# Altium schematic sheet USB-C_Power_Supply.SchDoc: USB-C Breadboard Power Supply
size A3; Author: Adrian S; Revision: 1.0; SheetNumber: 1; SheetTotal: 1
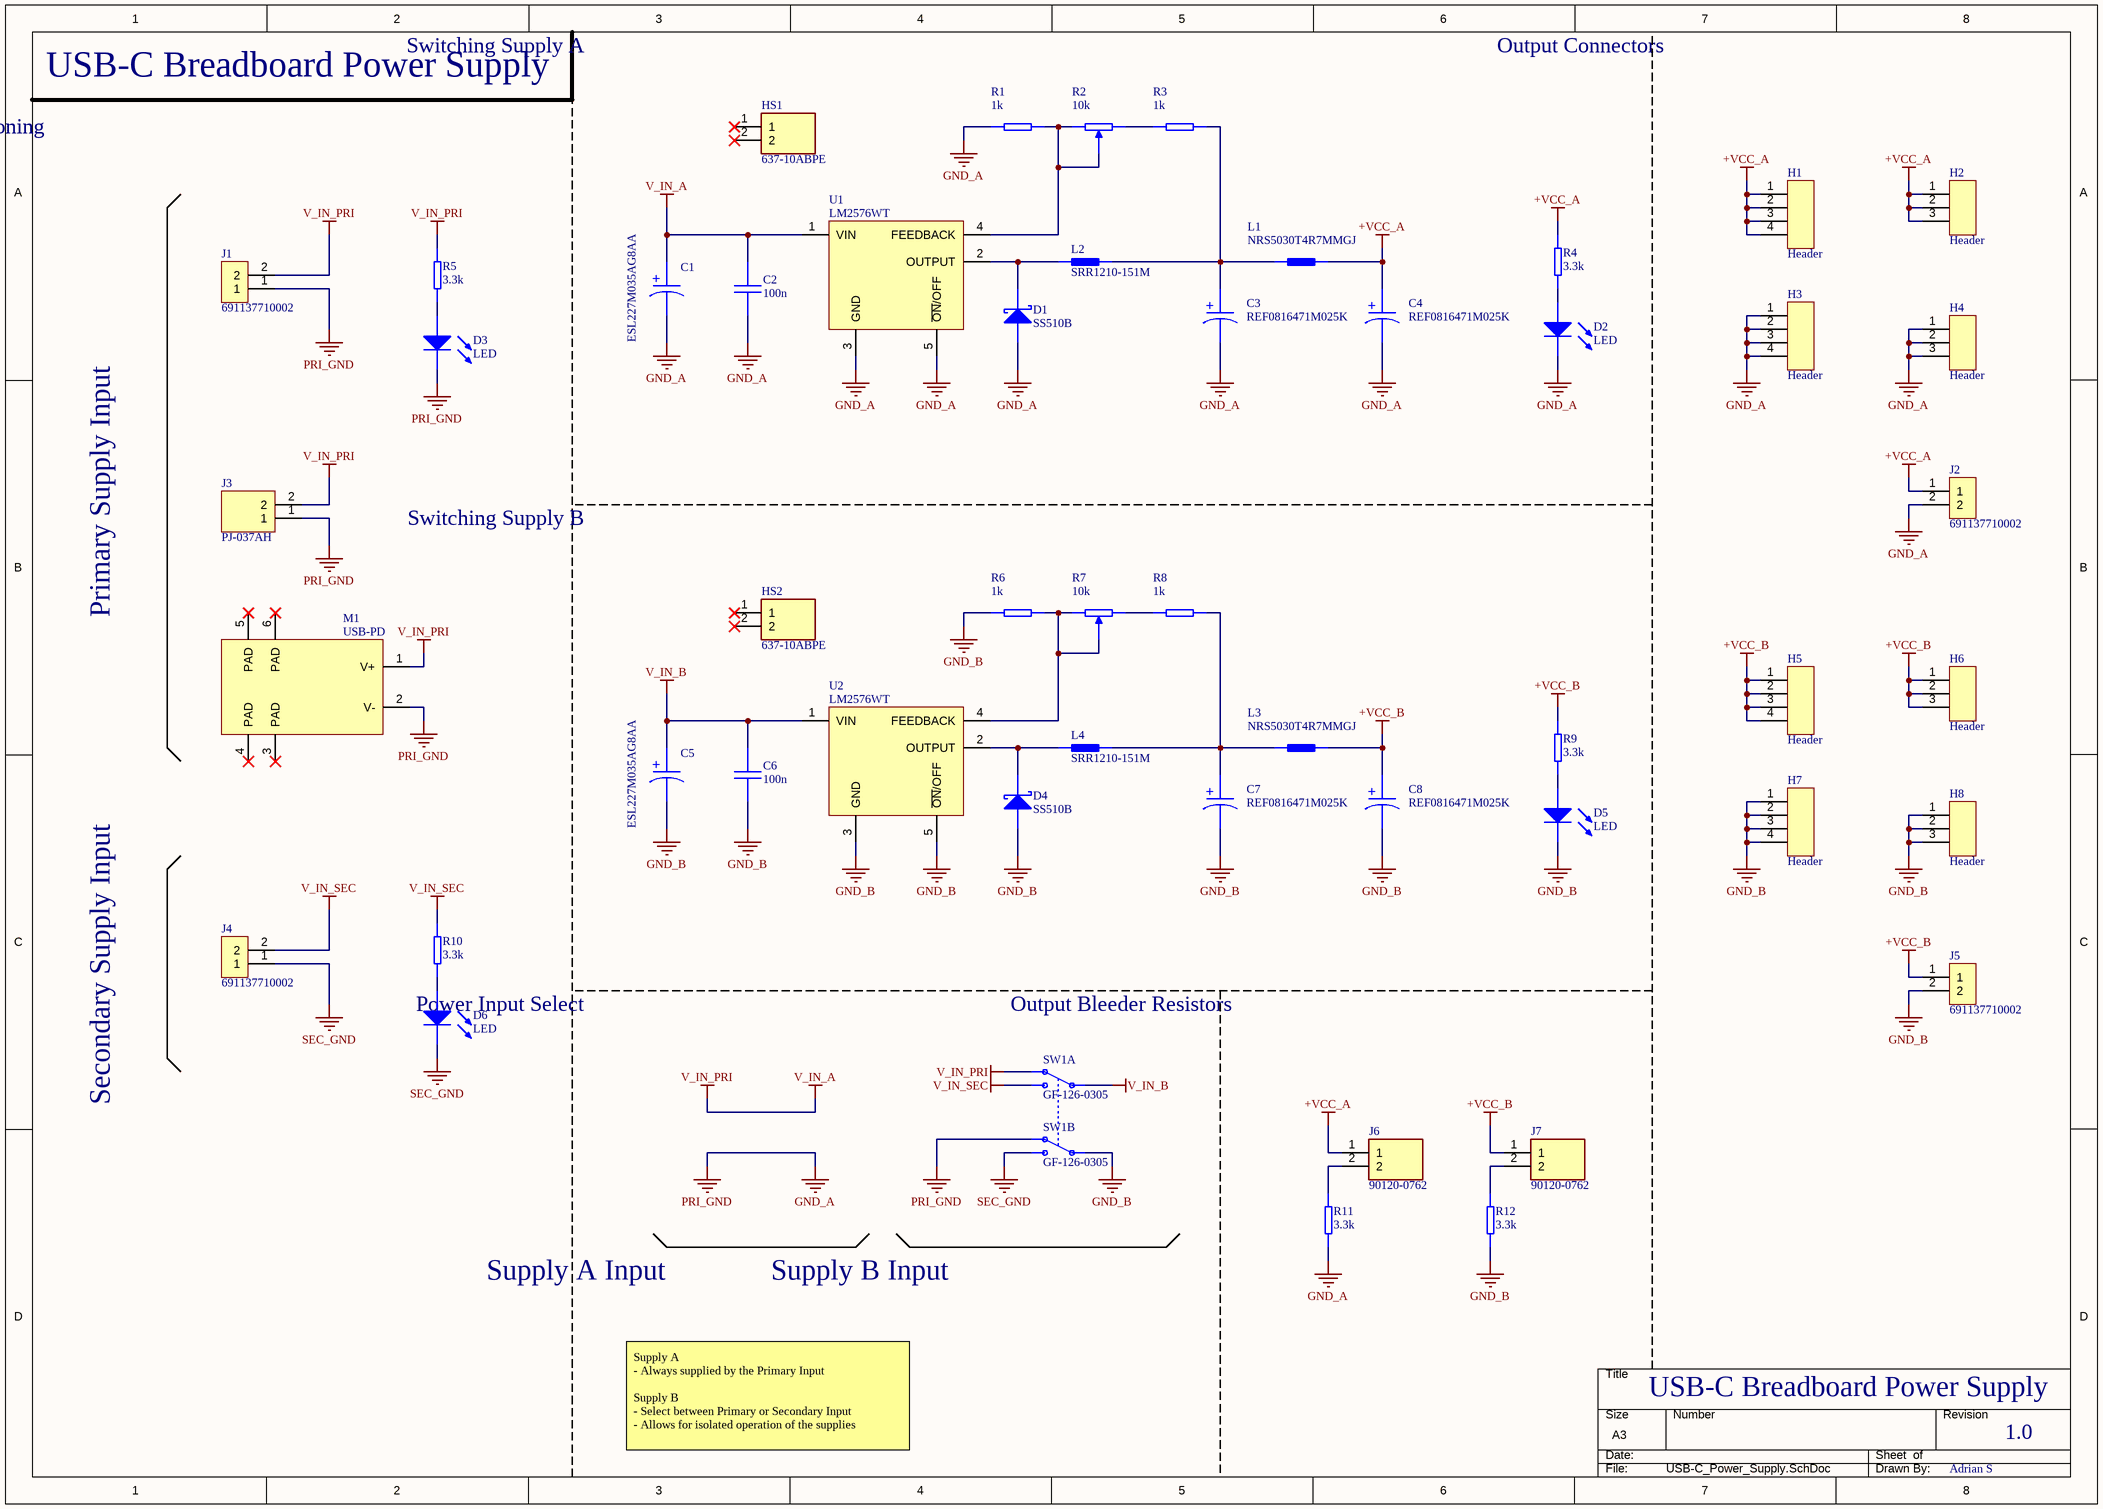
[diagram p0: USB-C_Power_Supply.SchDoc]

## Parts
C1  ESL227M035AG8AA  [CAPTH8.00X18.00-3.50]
C2  100n  [CAP0805]
C3  REF0816471M025K  [CAPTH8.00X16.00-3.50]
C4  REF0816471M025K  [CAPTH8.00X16.00-3.50]
C5  ESL227M035AG8AA  [CAPTH8.00X18.00-3.50]
C6  100n  [CAP0805]
C7  REF0816471M025K  [CAPTH8.00X16.00-3.50]
C8  REF0816471M025K  [CAPTH8.00X16.00-3.50]
D1  SS510B  [DO-214AC (SMA)]
D2  LED  [LEDM2012X80N]
D3  LED  [LEDM2012X80N]
D4  SS510B  [DO-214AC (SMA)]
D5  LED  [LEDM2012X80N]
D6  LED  [LEDM2012X80N]
H1  Header  [Header_1X4]
H2  Header  [Header_1X3]
H3  Header  [Header_1X4]
H4  Header  [Header_1X3]
H5  Header  [Header_1X4]
H6  Header  [Header_1X3]
H7  Header  [Header_1X4]
H8  Header  [Header_1X3]
HS1  637-10ABPE  [63710ABPE]
HS2  637-10ABPE  [63710ABPE]
J1  691137710002  [SHDR2W70P0X500_1X2_1000X750X1160P]
J2  691137710002  [SHDR2W70P0X500_1X2_1000X750X1160P]
J3  PJ-037AH  [PJ037AH]
J4  691137710002  [SHDR2W70P0X500_1X2_1000X750X1160P]
J5  691137710002  [SHDR2W70P0X500_1X2_1000X750X1160P]
J6  90120-0762  [Header_1X2]
J7  90120-0762  [Header_1X2]
L1  NRS5030T4R7MMGJ  [IND (4.9mmx4.9mm)]
L2  SRR1210-151M  [INDPM120120X1000N-D]
L3  NRS5030T4R7MMGJ  [IND (4.9mmx4.9mm)]
L4  SRR1210-151M  [INDPM120120X1000N-D]
M1  USB-PD  [USB_C-PD]
R1  1k  [RESC0805]
R2  10k  [3339P1103LF - Modified]
R3  1k  [RESC0805]
R4  3.3k  [RESC0805]
R5  3.3k  [RESC0805]
R6  1k  [RESC0805]
R7  10k  [3339P1103LF - Modified]
R8  1k  [RESC0805]
R9  3.3k  [RESC0805]
R10  3.3k  [RESC0805]
R11  3.3k  [RESC0805]
R12  3.3k  [RESC0805]
SW1  GF-126-0305  [GF1260305]  (parts A,B of 2)
U1  LM2576WT  [TO-220-5]
U2  LM2576WT  [TO-220-5]

## Nets
+VCC_A: C4.1 H1.1 H1.2 H1.3 H1.4 H2.1 H2.2 H2.3 J2.1 J6.1 L1.2 R4.1
+VCC_B: C8.1 H5.1 H5.2 H5.3 H5.4 H6.1 H6.2 H6.3 J5.1 J7.1 L3.2 R9.1
GND_A: C1.2 C2.2 C3.2 C4.2 D1.2(A) D2.1(K) D3.1(K) H3.1 H3.2 H3.3 H3.4 H4.1 H4.2 H4.3 J1.1 J2.2 J3.1 M1.2(V-) R1.2 R11.2 SW1.6 U1.3(GND) U1.5(~{ON}/OFF)  [also labelled PRI_GND]
GND_B: C5.2 C6.2 C7.2 C8.2 D4.2(A) D5.1(K) H7.1 H7.2 H7.3 H7.4 H8.1 H8.2 H8.3 J5.2 R6.2 R12.2 SW1.5 U2.3(GND) U2.5(~{ON}/OFF)
SEC_GND: D6.1(K) J4.1 SW1.4
V_IN_A: C1.1 C2.1 J1.2 J3.2 M1.1(V+) R5.1 SW1.1 U1.1(VIN)  [also labelled V_IN_PRI]
V_IN_B: C5.1 C6.1 SW1.2 U2.1(VIN)
V_IN_SEC: J4.2 R10.1 SW1.3
NetC3_1: C3.1 L1.1 L2.2 R3.1
NetC7_1: C7.1 L3.1 L4.2 R8.1
NetD1_1: D1.1(K) L2.1 U1.2(OUTPUT)
NetD2_2: D2.2(A) R4.2
NetD3_2: D3.2(A) R5.2
NetD4_1: D4.1(K) L4.1 U2.2(OUTPUT)
NetD5_2: D5.2(A) R9.2
NetD6_2: D6.2(A) R10.2
NetJ6_2: J6.2 R11.1
NetJ7_2: J7.2 R12.1
NetR1_1: R1.1 R2.2 R2.3 U1.4(FEEDBACK)
NetR2_1: R2.1 R3.2
NetR6_1: R6.1 R7.2 R7.3 U2.4(FEEDBACK)
NetR7_1: R7.1 R8.2

Not connected (* = marked no-connect by the designer): HS1 1* 2*; HS2 1* 2*; M1 3(PAD)* 4(PAD)* 5(PAD)* 6(PAD)*

## Notes on the sheet
- USB-C Breadboard Power Supply
- Switching Supply A
- Output Connectors
- Input Connectors and Conditioning
- Primary Supply Input
- Switching Supply B
- Secondary Supply Input
- Power Input Select
- Output Bleeder Resistors
- Supply A Input
- Supply B Input
- Supply A
  - Always supplied by the Primary Input
  Supply B
  - Select between Primary or Secondary Input
  - Allows for isolated operation of the supplies
- DWG. NO.
- REV.
- SHT.
- THIS DOCUMENT AND THE DATA DISCLOSED HEREIN OR HEREWITH IS THE PROPERTY OF ALTIUM LIMITED AND MAY BE FREELY DISTRIBUTED IN WHOLE. NO RIGHTS ARE RESERVED OR EXPRESS OR IMPLIED WARANTEE GIVEN.
- REVISION
- DESCRIPTION
- DATE
- APPROVED
- ENG:
- APPROVALS
- PROJECT
- DSN:
- CHK:
- REFERENCE DOCUMENTS
- PROJECT REVISION:
- TITLE
- DOCUMENT REVISION:
- DESIGN ITEM:
- BOM:
- FAB DWG:
- PCB DWG:
- ASSY DWG:
- SCALE:
- SIZE
- B
- CAGE CODE
- FILE NAME
- DWG NO.
- SHEET
- OF
- REV
- (in symbol ESL227M035AG8AA) +
- (in symbol REF0816471M025K) +

## Library data of the parts
C1 C5 = ESL227M035AG8AA: Capacitor Polarised; Manufacturer_Name: KEMET; Datasheet Link: https://content.kemet.com/datasheets/KEM_A4074_ESL.pdf; Height: 18mm; Manufacturer_Part_Number: ESL227M035AG8AA; Mouser Part Number: 80-ESL227M035AG8AA; Mouser Price/Stock: https://www.mouser.co.uk/ProductDetail/KEMET/ESL227M035AG8AA?qs=HXFqYaX1Q2yHN7oCVXkyWQ%3D%3D
C2 C6 = Capacitor - Non Polarized: Non Polarized Capacitor
C3 C4 C7 C8 = REF0816471M025K: Capacitor Polarised; Manufacturer_Name: Kyocera AVX; Datasheet Link: https://www.digikey.ph/en/products/detail/kyocera-avx/REF0816471M025K/20096764?msockid=39f1ec84d77b6f4428b7f904d6676eed; Height: 18mm; Manufacturer_Part_Number: REF0816471M025K; Mouser Part Number: 581-REF0816471M025K; Mouser Price/Stock: https://www.mouser.co.uk/ProductDetail/KYOCERA-AVX/REF0816471M025K?qs=Y0Uzf4wQF3mKMY7CWvU3GA%3D%3D
D1 D4 = SS510B: Diode; Manufacturer_Name: HY Electronic; Height: 2.44mm; Manufacturer_Part_Number: SS510B
D2 D3 D5 D6 = LED: General Purpose LED; ComponentLink1Description: Datasheet; ComponentLink1URL: https://www.smc-diodes.com/propdf/1N4148W%20N0571%20REV.E.pdf
H1 H3 H5 H7 = 4-Pin Header
H2 H4 H6 H8 = 3-Pin Header
HS1 HS2 = 637-10ABPE: Undefined or Miscellaneous; Manufacturer_Name: Wakefield Thermal; Datasheet Link: https://media.digikey.com/pdf/Data%20Sheets/Wakefield%20Thermal%20PDFs/634%20Heat%20Sinks.pdf; Height: 25.4mm; Manufacturer_Part_Number: 637-10ABPE; Mouser Part Number: 567-637-10ABPE; Mouser Price/Stock: https://www.mouser.co.uk/ProductDetail/Wakefield-Vette/637-10ABPE?qs=1%252ByrAFyf4wFy1bU0h8s7wA%3D%3D
J1 J2 J4 J5 = 691137710002: Connector; Manufacturer_Name: Wurth Elektronik; Datasheet Link: https://katalog.we-online.com/em/datasheet/691137710002.pdf; Height: 11.6mm; Manufacturer_Part_Number: 691137710002; Mouser Part Number: 710-691137710002; Mouser Price/Stock: https://www.mouser.co.uk/ProductDetail/Wurth-Elektronik/691137710002?qs=lBTPRtX1sU9LnHBbviNKGA%3D%3D
J3 = PJ-037AH: Connector; Manufacturer_Name: Same Sky; Datasheet Link: https://www.arrow.com/en/products/pj-037ah/cui-devices; Height: 11.2mm; Manufacturer_Part_Number: PJ-037AH; Mouser Part Number: 490-PJ-037AH; Mouser Price/Stock: https://www.mouser.co.uk/ProductDetail/CUI-Devices/PJ-037AH?qs=WyjlAZoYn50M7m1AkzfPaQ%3D%3D; Arrow Part Number: PJ-037AH; Arrow Price/Stock: https://www.arrow.com/en/products/pj-037ah/cui-devices?region=nac
J6 J7 = 90120-0762: Connector; Manufacturer_Name: Molex; Datasheet Link: http://www.molex.com/pdm_docs/sd/901200762_sd.pdf; Height: 5.6mm; Manufacturer_Part_Number: 90120-0762; Mouser Part Number: 538-90120-0762; Mouser Price/Stock: https://www.mouser.co.uk/ProductDetail/Molex/90120-0762?qs=NKHyz0HolODkarWFh2VFww%3D%3D; Arrow Part Number: 90120-0762; Arrow Price/Stock: https://www.arrow.com/en/products/90120-0762/molex?region=nac
L1 L3 = NRS5030T4R7MMGJ: Inductor; Manufacturer_Name: TAIYO YUDEN; Datasheet Link: https://www.yuden.co.jp/productdata/catalog/wound04_e.pdf; Height: 3.1mm; Manufacturer_Part_Number: NRS5030T4R7MMGJ; Mouser Part Number: 963-NRS5030T4R7MMGJ; Mouser Price/Stock: https://www.mouser.co.uk/ProductDetail/TAIYO-YUDEN/NRS5030T4R7MMGJ?qs=CNQs48zzdnpF%252BjDsFjbDtA%3D%3D; Arrow Part Number: NRS5030T4R7MMGJ; Arrow Price/Stock: null?utm_currency=USD&region=nac
L2 L4 = SRR1210-151M: Inductor; Manufacturer_Name: Bourns; Datasheet Link: https://www.bourns.com/docs/Product-Datasheets/SRR1210.pdf; Height: 10mm; Manufacturer_Part_Number: SRR1210-151M; Mouser Part Number: 652-SRR1210-151M; Mouser Price/Stock: https://www.mouser.co.uk/ProductDetail/Bourns/SRR1210-151M?qs=4vvWAaIu%2Fq7S1x5W5meWRQ%3D%3D; Arrow Part Number: SRR1210-151M; Arrow Price/Stock: https://www.arrow.com/en/products/srr1210-151m/bourns?region=nac
R1 R3-R6 R8-R12 = Resistor
R2 R7 = Potentiometer: Potentionmeter
SW1 = GF-126-0305: DPDT Slide Switch
U1 U2 = LM2576WT: Integrated Circuit; Manufacturer_Name: Microchip; Manufacturer_Part_Number: LM2576WU-TR; Datasheet Link: http://ww1.microchip.com/downloads/en/DeviceDoc/lm2576.pdf; Mouser Part Number: 998-LM2576WT; Mouser Price/Stock: https://www.mouser.co.uk/ProductDetail/Microchip-Technology/LM2576-5.0WU-TR?qs=Y3Q3JoKAO1SBuj%2FVzZkeQA%3D%3D; Arrow Part Number: LM2576-5.0WU-TR; Arrow Price/Stock: https://www.arrow.com/en/products/lm2576-5.0wu-tr/microchip-technology?region=nac